# Altium project tumlerV2.PrjPcb
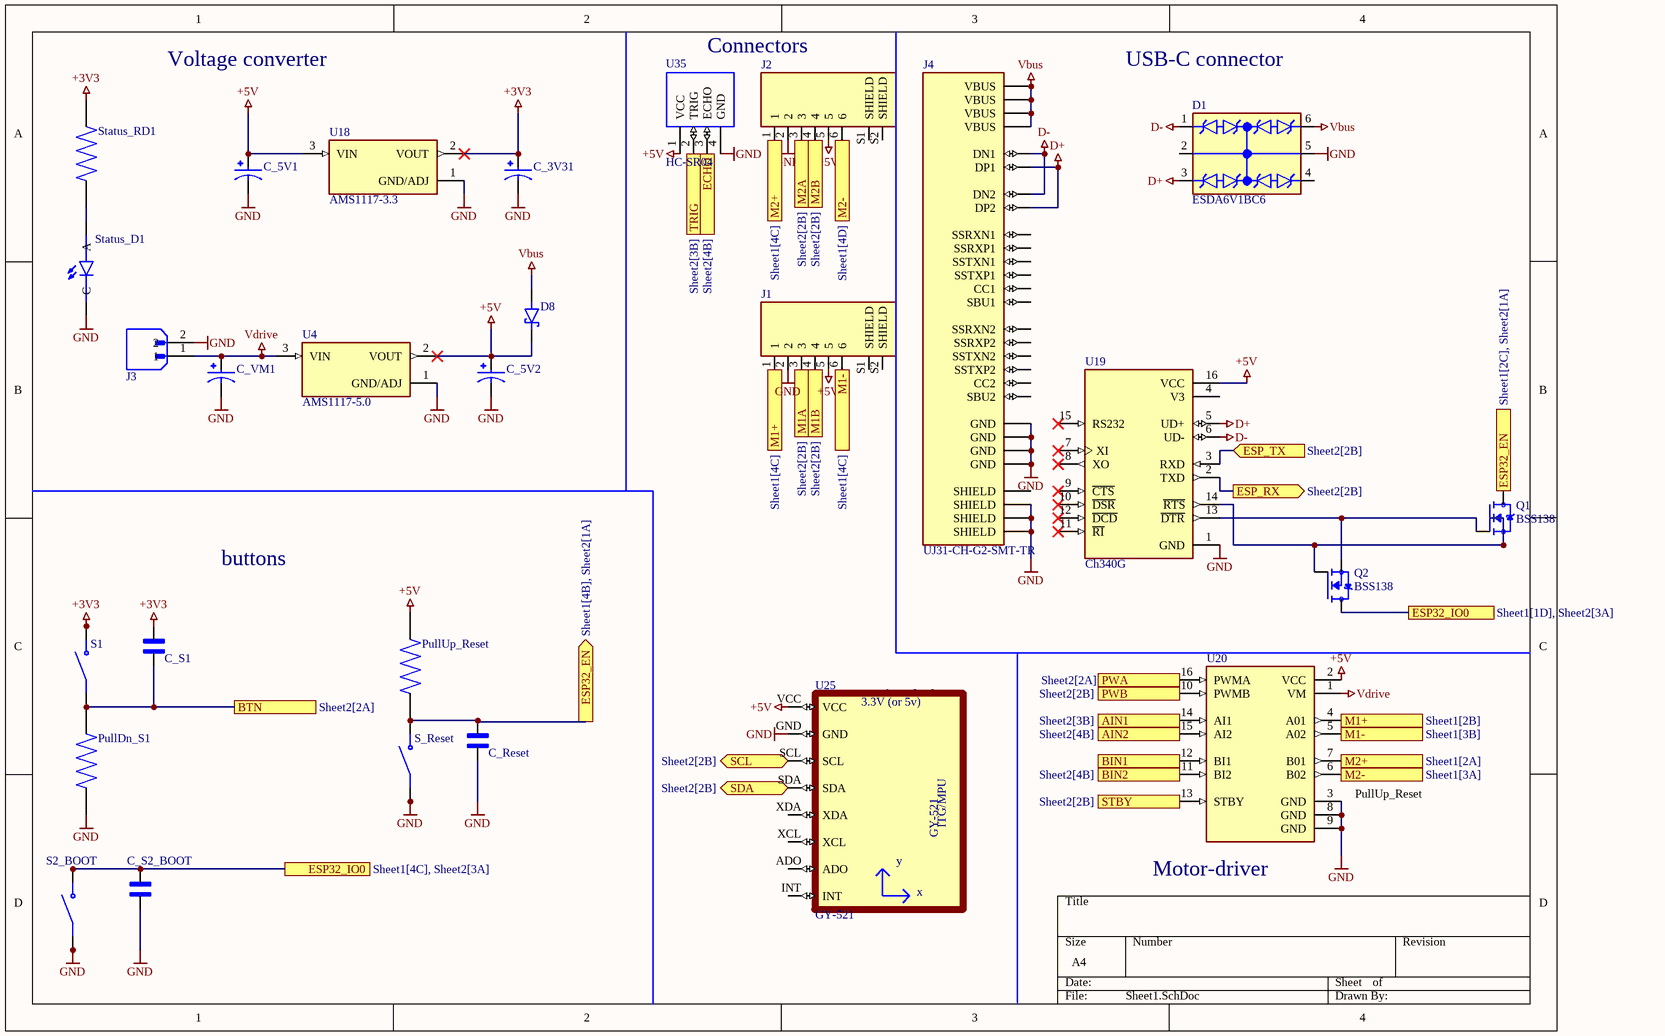
[diagram p0: Sheet1.SchDoc]
3 sheets, 55 parts. Net scope: flat (ports and power ports of the same name join across sheets).
Board file: PCB2.PcbDoc
Sheets:
  Sheet1.SchDoc
  Sheet3.SchDoc
  Sheet2.SchDoc

## Sheet Sheet1.SchDoc
size A4; SheetNumber: 1; SheetTotal: 3

### Parts
C_3V31  EEE-HC1H3R3R  [CAP_EEEHC1H3R3R]  (value not drawn)
C_5V1  EEE-HC1H3R3R  [CAP_EEEHC1H3R3R]  (value not drawn)
C_5V2  EEE-HC1H3R3R  [CAP_EEEHC1H3R3R]  (value not drawn)
C_Reset  GRM033R61C224ME14D  [CAPC0603X33N]  (value not drawn)
C_S1  GRM033R61C224ME14D  [CAPC0603X33N]  (value not drawn)
C_S2_BOOT  GRM033R61C224ME14D  [CAPC0603X33N]  (value not drawn)
C_VM1  EEE-HC1H3R3R  [CAP_EEEHC1H3R3R]  (value not drawn)
D1  ESDA6V1BC6  [SOT95P280X145-6N]
D8  1N5819HW-7  [SOD3715X145N]  (value not drawn)
J1  S6B-PH-SM4-TB (LF)(SN)  [JST_S6B-PH-SM4-TB(LF)(SN)]  (value not drawn)
J2  S6B-PH-SM4-TB (LF)(SN)  [JST_S6B-PH-SM4-TB(LF)(SN)]  (value not drawn)
J3  S2B-XH-A-1(LF)(SN)  [JST_S2B-XH-A-1(LF)(SN)]  (value not drawn)
J4  UJ31-CH-G2-SMT-TR  [CUI_UJ31-CH-G2-SMT-TR]
PullDn_S1  CRG0402F4K7  [RESC1005X40N]  (value not drawn)
PullUp_Reset  CRG0402F4K7  [RESC1005X40N]  (value not drawn)
Q1  BSS138  [SOT95P240X111-3N]
Q2  BSS138  [SOT95P240X111-3N]
S1  FSM2JSMLTR  [SW_1571527-2]  (value not drawn)
S2_BOOT  FSM2JSMLTR  [SW_1571527-2]  (value not drawn)
S_Reset  FSM2JSMLTR  [SW_1571527-2]  (value not drawn)
Status_D1  597-5004-407F  [LEDSC160X80X70L45N]  (value not drawn)
Status_RD1  CRG0201F1K4  [RESC0603X26N]  (value not drawn)
U4  AMS1117-5.0  [SOT229P700X180-4N]
U18  AMS1117-3.3  [SOT229P700X180-4N]
U19  Ch340G  [SOIC127P600X180-16N]
U20  ROB-14450  [MODULE_ROB-14450]  (value not drawn)
U25  GY-521  [GY-521]
U35  HC-SR04  [XCVR_HC-SR04]

### Ports
AIN1 (in, see Sheet2[3B]), AIN2 (in, see Sheet2[4B]), BIN1 (in, see Sheet2[3B]), BIN2 (in, see Sheet2[4B]), BTN (see Sheet2[2A]), ECHO (see Sheet2[4B]), ESP32_EN (out, see Sheet1[2C], Sheet2[1A]), ESP32_EN (out, see Sheet1[4B], Sheet2[1A]), ESP32_IO0 (see Sheet1[1D], Sheet2[3A]), ESP32_IO0 (see Sheet1[4C], Sheet2[3A]), ESP_RX (out, see Sheet2[2B]), ESP_TX (in, see Sheet2[2B]), M1+ (out, see Sheet1[2B]), M1+ (out, see Sheet1[4C]), M1- (out, see Sheet1[3B]), M1- (out, see Sheet1[4C]), M1A (see Sheet2[2B]), M1B (see Sheet2[2B]), M2+ (out, see Sheet1[2A]), M2+ (out, see Sheet1[4C]), M2- (out, see Sheet1[3A]), M2- (out, see Sheet1[4D]), M2A (see Sheet2[2B]), M2B (see Sheet2[2B]), PWA (in, see Sheet2[2A]), PWB (in, see Sheet2[2B]), SCL (bidir, see Sheet2[2B]), SDA (bidir, see Sheet2[2B]), STBY (in, see Sheet2[2B]), TRIG (see Sheet2[3B])

### Nets
+3V3: C_3V31.1 C_S1.2 S1.3(NO) S1.4(NO) Status_RD1.1 U18.2(VOUT)
+5V: C_5V1.1 C_5V2.1 D8.C(K) J1.5 J2.5 PullUp_Reset.2 U4.2(VOUT) U18.3(VIN) U19.16(VCC) U20.2(VCC) U25.VCC U35.1(VCC)
D+: D1.3(C2) J4.A6(DP1) J4.B6(DP2) U19.5(UD+)
D-: D1.1(C1) J4.A7(DN1) J4.B7(DN2) U19.6(UD-)
GND: C_3V31.2 C_5V1.2 C_5V2.2 C_Reset.1 C_S2_BOOT.2 C_VM1.2 D1.5(CC2) J1.2 J2.2 J3.2 J4.A1(GND) J4.A12(GND) J4.B1(GND) J4.B12(GND) J4.SH2(SHIELD) J4.SH3(SHIELD) J4.SH4(SHIELD) PullDn_S1.1 S2_BOOT.1(COM) S2_BOOT.2(COM) S_Reset.1(COM) S_Reset.2(COM) Status_D1.C U4.1(GND/ADJ) U18.1(GND/ADJ) U19.1(GND) U20.3(GND) U20.8(GND) U20.9(GND) U25.GND U35.4(GND)
Vbus: D1.6(C4) D8.A J4.A4(VBUS) J4.A9(VBUS) J4.B4(VBUS) J4.B9(VBUS)
Vdrive: C_VM1.1 J3.1 U4.3(VIN) U20.1(VM)
Net35_3: C_Reset.2 PullUp_Reset.1 Q1.3(D) S_Reset.3(NO) S_Reset.4(NO) ; port ESP32_EN
Net35_10: J2.4 ; port M2B
Net35_11: J1.4 ; port M1B
Net35_12: J1.3 ; port M1A
Net35_14: U35.3(ECHO) ; port ECHO
Net35_24: C_S1.1 PullDn_S1.2 S1.1(COM) S1.2(COM) ; port BTN
Net35_25: C_S2_BOOT.1 Q2.3(D) S2_BOOT.3(NO) S2_BOOT.4(NO) ; port ESP32_IO0
Net35_26: U20.16(PWMA) ; port PWA
Net35_27: U20.14(AI1) ; port AIN1
Net35_28: U20.13(STBY) ; port STBY
Net35_29: U35.2(TRIG) ; port TRIG
Net35_30: U20.10(PWMB) ; port PWB
Net35_31: J2.3 ; port M2A
Net35_33: U25.SDA ; port SDA
Net35_34: U19.2(TXD) ; port ESP_RX
Net35_35: U19.3(RXD) ; port ESP_TX
Net35_36: U25.SCL ; port SCL
Net35_37: U20.12(BI1) ; port BIN1
NetJ1_1: J1.1 U20.4(A01) ; port M1+
NetJ1_6: J1.6 U20.5(A02) ; port M1-
NetJ2_1: J2.1 U20.7(B01) ; port M2+
NetJ2_6: J2.6 U20.6(B02) ; port M2-
NetQ1_1: Q1.1(G) Q2.2(S) U19.13(~{DTR})
NetQ1_2: Q1.2(S) Q2.1(G) U19.14(~{RTS})
NetStatus_D1_A: Status_D1.A Status_RD1.2
NetU20_11: U20.11(BI2) ; port BIN2
NetU20_15: U20.15(AI2) ; port AIN2

Not connected (* = marked no-connect by the designer): D1 2(CC1) 4(C3); J1 S1(SHIELD) S2(SHIELD); J2 S1(SHIELD) S2(SHIELD); J4 A2(SSTXP1) A3(SSTXN1) A5(CC1) A8(SBU1) A10(SSRXN2) A11(SSRXP2) B2(SSTXP2) B3(SSTXN2) B5(CC2) B8(SBU2) B10(SSRXN1) B11(SSRXP1) SH1(SHIELD); U19 4(V3) 7(XI)* 8(XO)* 9(~{CTS})* 10(~{DSR})* 11(~{RI})* 12(~{DCD})* 15(RS232)*; U25 ADO INT XCL XDA

### Notes on the sheet
- Voltage converter
- Connectors
- USB-C connector
- buttons
- (near U20) PullUp_Reset
- (near U20) Motor-driver
- (in symbol GY-521) 3.3V (or 5v); ITG/MPU; y; x

### Library data of the parts
C_3V31 C_5V1 C_5V2 C_VM1 = EEE-HC1H3R3R: 10uF 16V dc Aluminium Electrolytic Capacitor; HC SMD Series 3000h 4(Dia.)x5.8mm; Value: 10µF; MF: Panasonic; Package: RADIAL-2 Panasonic; Availability: In Stock; Check_prices: https://www.snapeda.com/parts/EEE-HC1H3R3R/Panasonic/view-part/2309274/?ref=eda; Price: None; SnapEDA_Link: https://www.snapeda.com/parts/EEE-HC1H3R3R/Panasonic/view-part/2309274/?ref=snap; MP: EEE-HC1H3R3R; Supplier 1: Arrow Electronics; Supplier Part Number 1: VES100M1CTR-0405
C_Reset C_S1 C_S2_BOOT = GRM033R61C224ME14D: 0603; Value: 100n; MF: Murata; SnapEDA_Link: https://www.snapeda.com/parts/GRM033R61C224ME14D/Murata/view-part/?ref=snap; Package: 0603 Murata; MP: GRM033R61C224ME14D; Check_prices: https://www.snapeda.com/parts/GRM033R61C224ME14D/Murata/view-part/?ref=eda; ID: GRM033R61C224ME14D
D1 = ESDA6V1BC6: - Clamp - Ipp Tvs Diode Surface Mount SOT-23-6; MF: STMicroelectronics; Value: *; Price: None; Purchase-URL: https://pricing.snapeda.com/search/part/ESDA6V1BC6/?ref=eda; Package: SOT-23-6 STMicroelectronics; MP: ESDA6V1BC6; Availability: In Stock; Check_prices: https://www.snapeda.com/parts/ESDA6V1BC6/STMicroelectronics/view-part/?ref=eda; SnapEDA_Link: https://www.snapeda.com/parts/ESDA6V1BC6/STMicroelectronics/view-part/?ref=snap; Supplier 1: Mouser; Supplier Part Number 1: 511-ESDA6V1BC6
D8 = 1N5819HW-7: Diode Schottky 40 V 1A Surface Mount SOD-123; MF: Diodes Inc.; SnapEDA_Link: https://www.snapeda.com/parts/1N5819HW-7/Diodes+Inc./view-part/?ref=snap; Price: None; Check_prices: https://www.snapeda.com/parts/1N5819HW-7/Diodes+Inc./view-part/?ref=eda; Availability: In Stock; Value: *; MP: 1N5819HW-7; Package: SOD-123 Fairchild Semiconductor; Purchase-URL: https://pricing.snapeda.com/search/part/1N5819HW-7/?ref=eda
J1 J2 = S6B-PH-SM4-TB (LF)(SN): Connector Header Surface Mount, Right Angle 6 position 0.079 (2.00mm); MF: JST Sales; SnapEDA_Link: https://www.snapeda.com/parts/S6B-PH-SM4-TB%20(LF)(SN)/JST/view-part/?ref=snap; Package: None; Value: *; MP: S6B-PH-SM4-TB (LF)(SN); Check_prices: https://www.snapeda.com/parts/S6B-PH-SM4-TB%20(LF)(SN)/JST/view-part/?ref=eda; Supplier 1: Rs; Supplier Part Number 1: 6881369P
J3 = S2B-XH-A-1(LF)(SN): Connector Header Through Hole, Right Angle 2 position 0.098 (2.50mm); MF: JST Sales; SnapEDA_Link: https://www.snapeda.com/parts/S2B-XH-A-1(LF)(SN)/JST+Sales+America+Inc./view-part/?ref=snap; Package: None; Value: *; MP: S2B-XH-A-1(LF)(SN); Check_prices: https://www.snapeda.com/parts/S2B-XH-A-1(LF)(SN)/JST+Sales+America+Inc./view-part/?ref=eda; Supplier 1: Mouser; Supplier Part Number 1: 306-S2BXHA1LFSN
J4 = UJ31-CH-G2-SMT-TR: Type C, USB 3.2 Gen 2, 10 Gbps, 20 Vdc, 5 A, Right Angle, Surface Mount, Black Insulator, USB Receptacle; MF: Same Sky; SnapEDA_Link: https://www.snapeda.com/parts/UJ31-CH-G2-SMT-TR/Same+Sky/view-part/?ref=snap; Package: None; Value: *; MP: UJ31-CH-G2-SMT-TR; Check_prices: https://www.snapeda.com/parts/UJ31-CH-G2-SMT-TR/Same+Sky/view-part/?ref=eda; Supplier 1: Mouser; Supplier Part Number 1: 490-UJ31-CH-G2SMT-TR
PullDn_S1 PullUp_Reset = CRG0402F4K7: Thick Film Smnt Resistor 0402 Case 4.7kOhm +/-1% 0.063W +/-100ppm/degC | TE Connectivity CRG0402F4K7; Power_Rating: .063 W; Resistance: 10k; Voltage_Rating: 50 V; Tolerance: 1%; SnapEDA_Link: https://www.snapeda.com/parts/CRG0402F4K7/TE+Connectivity+Passive+Product/view-part/?ref=snap; Package: 0402; Value: *; MF: TE Connectivity; MP: CRG0402F4K7; Check_prices: https://www.snapeda.com/parts/CRG0402F4K7/TE+Connectivity+Passive+Product/view-part/?ref=eda
Q1 Q2 = BSS138: N-Channel 50 V 220mA (Ta) 350mW (Ta) Surface Mount SOT-23-3; MF: onsemi; SnapEDA_Link: https://www.snapeda.com/parts/BSS138/Onsemi/view-part/?ref=snap; Package: SOT-23-3 ON Semiconductor; Value: *; MP: BSS138; Check_prices: https://www.snapeda.com/parts/BSS138/Onsemi/view-part/?ref=eda; Supplier 1: Future Electronics; Supplier Part Number 1: 7723794
S1 S2_BOOT S_Reset = FSM2JSMLTR: Switch Tactile OFF (ON) SPST Round Button Gull Wing 0.05A 24VDC 0.98N SMD T/R; MF: TE Connectivity; SnapEDA_Link: https://www.snapeda.com/parts/FSM2JSMLTR/TE+Connectivity+ALCOSWITCH+Switches/view-part/?ref=snap; Package: None; Value: *; MP: FSM2JSMLTR; Check_prices: https://www.snapeda.com/parts/FSM2JSMLTR/TE+Connectivity+ALCOSWITCH+Switches/view-part/?ref=eda; Supplier 1: Avnet; Supplier Part Number 1: 23R8458
Status_D1 = 597-5004-407F: SMD LED 0603 R 7 REEL; Discretes | Dialight 597-5004-407F; SnapEDA_Link: https://www.snapeda.com/parts/597-5004-407F/Dialight/view-part/?ref=snap; Package: 0603 Dialight; Value: *; MF: Dialight; MP: 597-5004-407F; Check_prices: https://www.snapeda.com/parts/597-5004-407F/Dialight/view-part/?ref=eda; Supplier 1: Farnell; Supplier Part Number 1: 1867024
Status_RD1 = CRG0201F1K4: Res Thick Film 0201 100 Ohm 1% 1/20W Â±200ppm/Â°C Molded SMD T/R; Power_Rating: .05 W; Resistance: 100; MF: TE Connectivity; Voltage_Rating: 25 V; SnapEDA_Link: https://www.snapeda.com/parts/CRG0201F1K4/TE+Connectivity/view-part/?ref=snap; Package: 0201; Value: *; MP: CRG0201F1K4; EU_RoHS_Compliance: Compliant with Exemptions; Tolerance: 1%; Check_prices: https://www.snapeda.com/parts/CRG0201F1K4/TE+Connectivity/view-part/?ref=eda; Supplier 1: Rs; Supplier Part Number 1: 7550164
U4 = AMS1117-5.0: 1A LOW DROPOUT VOLTAGE REGULATOR; MF: ams; SnapEDA_Link: https://www.snapeda.com/parts/AMS1117-5.0/ams/view-part/?ref=snap; Package: SOT-223 Seeed Technology; Value: *; MP: AMS1117-5.0; Check_prices: https://www.snapeda.com/parts/AMS1117-5.0/ams/view-part/?ref=eda
U18 = AMS1117-3.3: Sot223/Pkg 1-Amp 3.3-Volt Low Drop Out Voltage Regulatator; MF: Advanced Monolithic Systems; SnapEDA_Link: https://www.snapeda.com/parts/AMS1117-3.3/Advanced+Monolithic+Systems/view-part/?ref=snap; Package: SOT-223 Seeed Technology; Value: *; MP: AMS1117-3.3; Check_prices: https://www.snapeda.com/parts/AMS1117-3.3/Advanced+Monolithic+Systems/view-part/?ref=eda; Supplier 1: Digikey; Supplier Part Number 1: 4518-AMS1117-3.3CT-ND
U19 = Ch340G: USB Interface Integrated Circuit; MF: WCH; SnapEDA_Link: https://www.snapeda.com/parts/Ch340G/WCH/view-part/?ref=snap; Package: None; Value: *; MP: Ch340G; Check_prices: https://www.snapeda.com/parts/Ch340G/WCH/view-part/?ref=eda
U20 = ROB-14450: TB6612FNG Motor Controller/Driver Power Management Evaluation Board; MF: SparkFun Electronics; Check_prices: https://www.snapeda.com/parts/ROB-14450/SparkFun%20Electronics/view-part/2656367/?ref=eda; Package: None; MP: ROB-14450; Value: *; Availability: In Stock; SnapEDA_Link: https://www.snapeda.com/parts/ROB-14450/SparkFun%20Electronics/view-part/2656367/?ref=snap; Price: None
U25 = GY-521: Triple Axis Accelerometer Gyro Breakout; MF: GODREAM FORDREAM CO., LIMITED; SnapEDA_Link: https://www.snapeda.com/parts/GY-521/GODREAM+FORDREAM+CO.%252C+LIMITED/view-part/?ref=snap; Package: Package; Value: *; MP: GY-521; Check_prices: https://www.snapeda.com/parts/GY-521/GODREAM+FORDREAM+CO.%252C+LIMITED/view-part/?ref=eda
U35 = HC-SR04: Ultrasonic Sensor Module; Availability: Unavailable; MP: HC-SR04; Value: *; Price: None; Package: None

## Sheet Sheet3.SchDoc
size A4; SheetNumber: 2; SheetTotal: 3
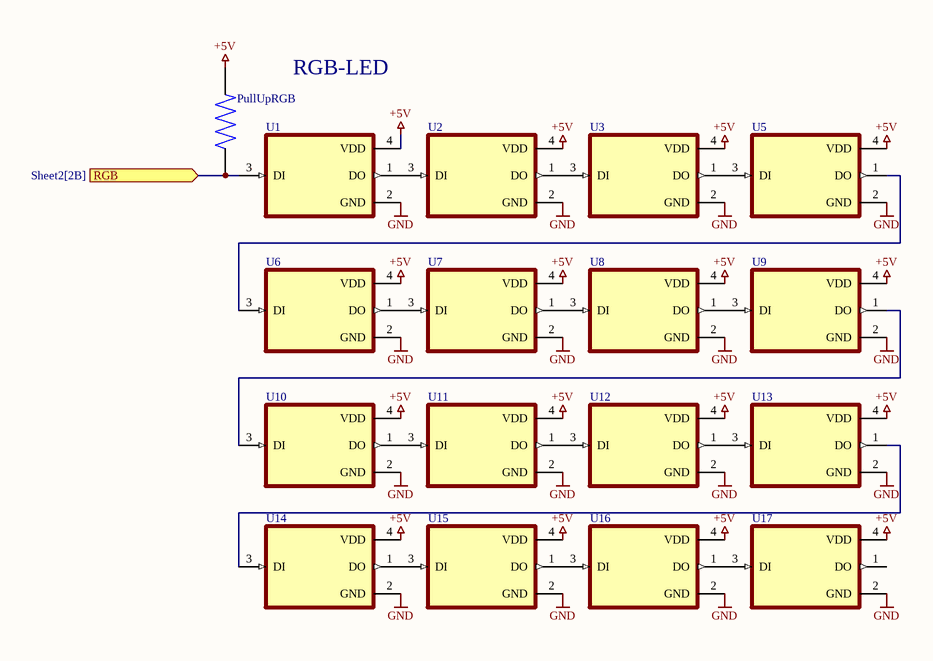
[diagram p1: Sheet3.SchDoc]

### Parts
PullUpRGB  CRG0402F4K7  [RESC1005X40N]  (value not drawn)
U1  WS2812-2020  [LED_WS2812-2020]  (value not drawn)
U2  WS2812-2020  [LED_WS2812-2020]  (value not drawn)
U3  WS2812-2020  [LED_WS2812-2020]  (value not drawn)
U5  WS2812-2020  [LED_WS2812-2020]  (value not drawn)
U6  WS2812-2020  [LED_WS2812-2020]  (value not drawn)
U7  WS2812-2020  [LED_WS2812-2020]  (value not drawn)
U8  WS2812-2020  [LED_WS2812-2020]  (value not drawn)
U9  WS2812-2020  [LED_WS2812-2020]  (value not drawn)
U10  WS2812-2020  [LED_WS2812-2020]  (value not drawn)
U11  WS2812-2020  [LED_WS2812-2020]  (value not drawn)
U12  WS2812-2020  [LED_WS2812-2020]  (value not drawn)
U13  WS2812-2020  [LED_WS2812-2020]  (value not drawn)
U14  WS2812-2020  [LED_WS2812-2020]  (value not drawn)
U15  WS2812-2020  [LED_WS2812-2020]  (value not drawn)
U16  WS2812-2020  [LED_WS2812-2020]  (value not drawn)
U17  WS2812-2020  [LED_WS2812-2020]  (value not drawn)

### Ports
RGB (in, see Sheet2[2B])

### Nets
+5V: PullUpRGB.2 U1.4(VDD) U2.4(VDD) U3.4(VDD) U5.4(VDD) U6.4(VDD) U7.4(VDD) U8.4(VDD) U9.4(VDD) U10.4(VDD) U11.4(VDD) U12.4(VDD) U13.4(VDD) U14.4(VDD) U15.4(VDD) U16.4(VDD) U17.4(VDD)
GND: U1.2(GND) U2.2(GND) U3.2(GND) U5.2(GND) U6.2(GND) U7.2(GND) U8.2(GND) U9.2(GND) U10.2(GND) U11.2(GND) U12.2(GND) U13.2(GND) U14.2(GND) U15.2(GND) U16.2(GND) U17.2(GND)
Net35_23: PullUpRGB.1 U1.3(DI) ; port RGB
NetU1_1: U1.1(DO) U2.3(DI)
NetU2_1: U2.1(DO) U3.3(DI)
NetU3_1: U3.1(DO) U5.3(DI)
NetU5_1: U5.1(DO) U6.3(DI)
NetU6_1: U6.1(DO) U7.3(DI)
NetU7_1: U7.1(DO) U8.3(DI)
NetU8_1: U8.1(DO) U9.3(DI)
NetU9_1: U9.1(DO) U10.3(DI)
NetU10_1: U10.1(DO) U11.3(DI)
NetU11_1: U11.1(DO) U12.3(DI)
NetU12_1: U12.1(DO) U13.3(DI)
NetU13_1: U13.1(DO) U14.3(DI)
NetU14_1: U14.1(DO) U15.3(DI)
NetU15_1: U15.1(DO) U16.3(DI)
NetU16_1: U16.1(DO) U17.3(DI)

Not connected (* = marked no-connect by the designer): U17 1(DO)

### Notes on the sheet
- RGB-LED

### Library data of the parts
PullUpRGB = CRG0402F4K7: as PullDn_S1 on sheet Sheet1; SnapEDA_Link: https://www.snapeda.com/parts/CRG0402F4K7/TE+Connectivity+Passive+Product/view-part/?ref=snap; Package: 0402; Value: *; MF: TE Connectivity; MP: CRG0402F4K7; Check_prices: https://www.snapeda.com/parts/CRG0402F4K7/TE+Connectivity+Passive+Product/view-part/?ref=eda
U1-U3 U5-U17 = WS2812-2020: Intelligent control LED light source, SMD-4; MF: Worldsemi; MP: WS2812-2020; Availability: Not in stock; Package: Package; SnapEDA_Link: https://www.snapeda.com/parts/WS2812-2020/Worldsemi/view-part/?ref=snap; Check_prices: https://www.snapeda.com/parts/WS2812-2020/Worldsemi/view-part/?ref=eda; Value: *; Price: None
  U1: ComponentLink1Description: New link; ComponentLink1URL: *; Supplier 1: Mouser; Supplier Part Number 1: 485-1655

## Sheet Sheet2.SchDoc
size A4; SheetNumber: 3; SheetTotal: 3
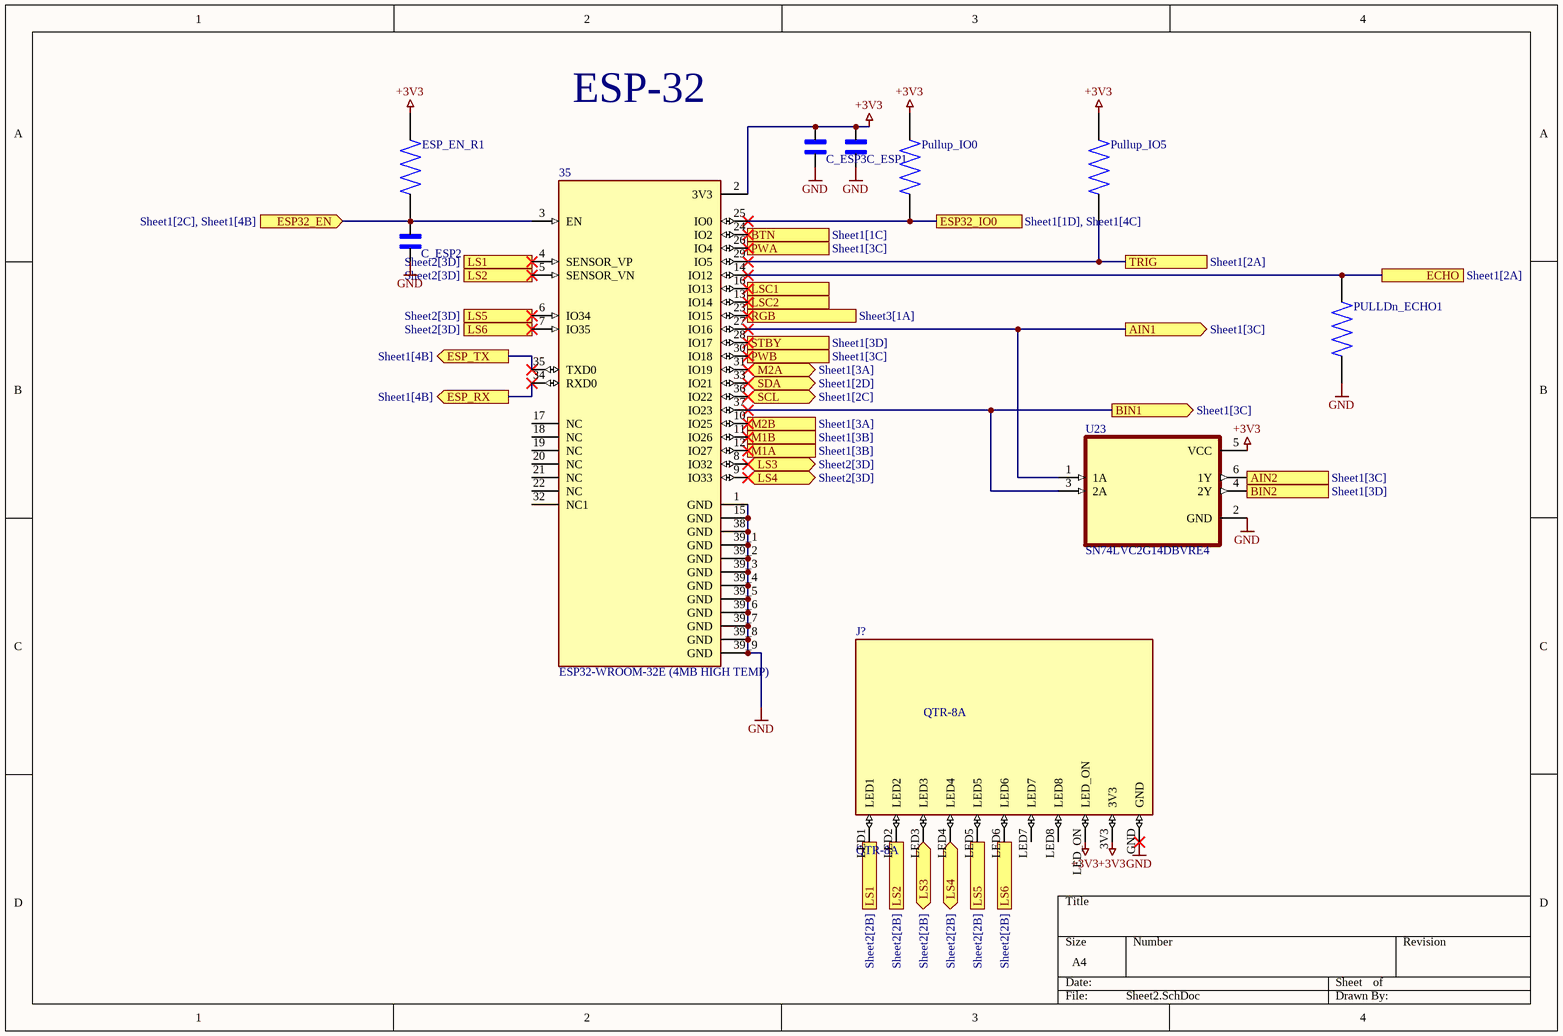
[diagram p2: Sheet2.SchDoc]

### Parts
35  ESP32-WROOM-32E (4MB HIGH TEMP)  [XCVR_ESP32-WROOM-32E_(4MB_HIGH_TEMP)]
C_ESP1  GRM033R61C224ME14D  [CAPC0603X33N]  (value not drawn)
C_ESP2  GRM033R61C224ME14D  [CAPC0603X33N]  (value not drawn)
C_ESP3  GRM033R61C224ME14D  [CAPC0603X33N]  (value not drawn)
ESP_EN_R1  CRG0402F4K7  [RESC1005X40N]  (value not drawn)
J?  QTR-8A  [QTR-8A]
PULLDn_ECHO1  CRG0402F4K7  [RESC1005X40N]  (value not drawn)
Pullup_IO0  CRG0402F4K7  [RESC1005X40N]  (value not drawn)
Pullup_IO5  CRG0402F4K7  [RESC1005X40N]  (value not drawn)
U23  SN74LVC2G14DBVRE4  [SOT95P280X145-6N]

### Ports
AIN1 (out, see Sheet1[3C]), AIN2 (out, see Sheet1[3C]), BIN1 (out, see Sheet1[3C]), BIN2 (out, see Sheet1[3D]), BTN (see Sheet1[1C]), ECHO (see Sheet1[2A]), ESP32_EN (in, see Sheet1[2C], Sheet1[4B]), ESP32_IO0 (see Sheet1[1D], Sheet1[4C]), ESP_RX (out, see Sheet1[4B]), ESP_TX (out, see Sheet1[4B]), LS1 (see Sheet2[2B]), LS1 (see Sheet2[3D]), LS2 (see Sheet2[2B]), LS2 (see Sheet2[3D]), LS3 (bidir, see Sheet2[2B]), LS3 (bidir, see Sheet2[3D]), LS4 (bidir, see Sheet2[2B]), LS4 (bidir, see Sheet2[3D]), LS5 (see Sheet2[2B]), LS5 (see Sheet2[3D]), LS6 (see Sheet2[2B]), LS6 (see Sheet2[3D]), LSC1, LSC2, M1A (see Sheet1[3B]), M1B (see Sheet1[3B]), M2A (bidir, see Sheet1[3A]), M2B (see Sheet1[3A]), PWA (out, see Sheet1[3C]), PWB (out, see Sheet1[3C]), RGB (out, see Sheet3[1A]), SCL (bidir, see Sheet1[2C]), SDA (bidir, see Sheet1[2D]), STBY (out, see Sheet1[3D]), TRIG (see Sheet1[2A])

### Nets
+3V3: 35.2(3V3) C_ESP1.2 C_ESP3.2 ESP_EN_R1.2 J?.3V3 J?.LED_ON Pullup_IO0.2 Pullup_IO5.2 U23.5(VCC)
GND: 35.1(GND) 35.15(GND) 35.38(GND) 35.39_1(GND) 35.39_2(GND) 35.39_3(GND) 35.39_4(GND) 35.39_5(GND) 35.39_6(GND) 35.39_7(GND) 35.39_8(GND) 35.39_9(GND) C_ESP1.1 C_ESP2.1 C_ESP3.1 J?.GND PULLDn_ECHO1.1 U23.2(GND)
Net35_3: 35.3(EN) C_ESP2.2 ESP_EN_R1.1 ; port ESP32_EN
Net35_4: 35.4(SENSOR_VP) J?.LED1 ; port LS1
Net35_5: 35.5(SENSOR_VN) J?.LED2 ; port LS2
Net35_6: 35.6(IO34) J?.LED5 ; port LS5
Net35_7: 35.7(IO35) J?.LED6 ; port LS6
Net35_8: 35.8(IO32) J?.LED3 ; port LS3
Net35_9: 35.9(IO33) J?.LED4 ; port LS4
Net35_10: 35.10(IO25) ; port M2B
Net35_11: 35.11(IO26) ; port M1B
Net35_12: 35.12(IO27) ; port M1A
Net35_13: 35.13(IO14) ; port LSC2
Net35_14: 35.14(IO12) PULLDn_ECHO1.2 ; port ECHO
Net35_16: 35.16(IO13) ; port LSC1
Net35_23: 35.23(IO15) ; port RGB
Net35_24: 35.24(IO2) ; port BTN
Net35_25: 35.25(IO0) Pullup_IO0.1 ; port ESP32_IO0
Net35_26: 35.26(IO4) ; port PWA
Net35_27: 35.27(IO16) U23.1(1A) ; port AIN1
Net35_28: 35.28(IO17) ; port STBY
Net35_29: 35.29(IO5) Pullup_IO5.1 ; port TRIG
Net35_30: 35.30(IO18) ; port PWB
Net35_31: 35.31(IO19) ; port M2A
Net35_33: 35.33(IO21) ; port SDA
Net35_34: 35.34(RXD0) ; port ESP_RX
Net35_35: 35.35(TXD0) ; port ESP_TX
Net35_36: 35.36(IO22) ; port SCL
Net35_37: 35.37(IO23) U23.3(2A) ; port BIN1
NetU20_11: U23.4(2Y) ; port BIN2
NetU20_15: U23.6(1Y) ; port AIN2

Not connected (* = marked no-connect by the designer): 35 17(NC) 18(NC) 19(NC) 20(NC) 21(NC) 22(NC) 32(NC1); J? LED7 LED8

### Notes on the sheet
- ESP-32

### Library data of the parts
35 = ESP32-WROOM-32E (4MB HIGH TEMP): MF: Espressif Systems; Package: SMD-44 Espressif Systems; Check_prices: https://www.snapeda.com/parts/ESP32-WROOM-32E%20(4MB%20HIGH%20TEMP)/Espressif+Systems/view-part/?ref=eda; Value: *; Price: None; MP: ESP32-WROOM-32E (4MB HIGH TEMP); Purchase-URL: https://pricing.snapeda.com/search/part/ESP32-WROOM-32E (4MB HIGH TEMP)/?ref=eda; SnapEDA_Link: https://www.snapeda.com/parts/ESP32-WROOM-32E%20(4MB%20HIGH%20TEMP)/Espressif+Systems/view-part/?ref=snap; Availability: In Stock; ID: ESP32-WROOM-32E (4MB HIGH TEMP); Supplier 1: Digikey; Supplier Part Number 1: 1904-ESP32-WROOM-32E(M113EH3200PH3Q0)TR-ND
C_ESP1 = GRM033R61C224ME14D: 0603; Value: 1µ; MF: Murata; SnapEDA_Link: https://www.snapeda.com/parts/GRM033R61C224ME14D/Murata/view-part/?ref=snap; Package: 0603 Murata; MP: GRM033R61C224ME14D; Check_prices: https://www.snapeda.com/parts/GRM033R61C224ME14D/Murata/view-part/?ref=eda; ID: GRM033R61C224ME14D; Supplier 1: Avnet; Supplier Part Number 1: LMK107B7105KA-T; Supplier 2: Mouser; Supplier Part Number 2: 81-GCM188R71E105KA4D
C_ESP2 = GRM033R61C224ME14D: 0603 100n; MF: Murata; SnapEDA_Link: https://www.snapeda.com/parts/GRM033R61C224ME14D/Murata/view-part/?ref=snap; Package: 0603 Murata; Value: 100n; MP: GRM033R61C224ME14D; Check_prices: https://www.snapeda.com/parts/GRM033R61C224ME14D/Murata/view-part/?ref=eda; ID: GRM033R61C224ME14D; Supplier 1: Mouser; Supplier Part Number 1: 81-GRM033R61C224ME4D
C_ESP3 = GRM033R61C224ME14D: 0603; Value: 10µ; MF: Murata; SnapEDA_Link: https://www.snapeda.com/parts/GRM033R61C224ME14D/Murata/view-part/?ref=snap; Package: 0603 Murata; MP: GRM033R61C224ME14D; Check_prices: https://www.snapeda.com/parts/GRM033R61C224ME14D/Murata/view-part/?ref=eda; ID: GRM033R61C224ME14D; Supplier 1: Mouser; Supplier Part Number 1: 810-C1608X5R1E225K
ESP_EN_R1 = CRG0402F4K7: Thick Film Smnt Resistor 0402 Case 10kOhm +/-1% 0.063W +/-100ppm/degC | TE Connectivity; Power_Rating: .063 W; Resistance: 10k; Voltage_Rating: 50 V; Tolerance: 1%; SnapEDA_Link: https://www.snapeda.com/parts/CRG0402F4K7/TE+Connectivity+Passive+Product/view-part/?ref=snap; Package: 0402; Value: *; MF: TE Connectivity; MP: CRG0402F4K7; Check_prices: https://www.snapeda.com/parts/CRG0402F4K7/TE+Connectivity+Passive+Product/view-part/?ref=eda; Supplier 1: Avnet; Supplier Part Number 1: RC1005F1002CS; Supplier 2: Mouser; Supplier Part Number 2: 667-ERT-J0ER103J; Supplier 3: Farnell; Supplier Part Number 3: 2072516RL
J? = QTR-8A: QRE1113GR series Phototransistor Sensor Evaluation Board; MF: Pololu; SnapEDA_Link: https://www.snapeda.com/parts/QTR-8A/Pololu/view-part/?ref=snap; Package: None; Value: *; MP: QTR-8A; Check_prices: https://www.snapeda.com/parts/QTR-8A/Pololu/view-part/?ref=eda
PULLDn_ECHO1 Pullup_IO0 = CRG0402F4K7: as PullDn_S1 on sheet Sheet1; SnapEDA_Link: https://www.snapeda.com/parts/CRG0402F4K7/TE+Connectivity+Passive+Product/view-part/?ref=snap; Package: 0402; Value: *; MF: TE Connectivity; MP: CRG0402F4K7; Check_prices: https://www.snapeda.com/parts/CRG0402F4K7/TE+Connectivity+Passive+Product/view-part/?ref=eda
  PULLDn_ECHO1: Supplier 1: Mouser; Supplier Part Number 1: 81-NCP15XV103J03RC
Pullup_IO5 = CRG0402F4K7: Thick Film Smnt Resistor 0402 Case 10kOhm +/-1% 0.063W +/-100ppm/degC | TE Connectivity CRG0402F4K7; Power_Rating: .063 W; Resistance: 10k; Voltage_Rating: 50 V; Tolerance: 1%; SnapEDA_Link: https://www.snapeda.com/parts/CRG0402F4K7/TE+Connectivity+Passive+Product/view-part/?ref=snap; Package: 0402; Value: *; MF: TE Connectivity; MP: CRG0402F4K7; Check_prices: https://www.snapeda.com/parts/CRG0402F4K7/TE+Connectivity+Passive+Product/view-part/?ref=eda; Supplier 1: Mouser; Supplier Part Number 1: 81-NCP15XV103J03RC
U23 = SN74LVC2G14DBVRE4: Dual Schmitt-Trigger Inverter 6-SOT-23 -40 to 125; MF: Texas Instruments; Price: None; Availability: In Stock; Check_prices: https://www.snapeda.com/parts/SN74LVC2G14DBVRE4/Texas+Instruments/view-part/?ref=eda; MP: SN74LVC2G14DBVRE4; Package: SOT-23-6 Texas Instruments; SnapEDA_Link: https://www.snapeda.com/parts/SN74LVC2G14DBVRE4/Texas+Instruments/view-part/?ref=snap; Value: *; Purchase-URL: https://pricing.snapeda.com/search/part/SN74LVC2G14DBVRE4/?ref=eda; Supplier 1: Mouser; Supplier Part Number 1: 595-SN74LVC2G14DBVE4

## Nets that join several sheets
+3V3: Sheet1 (6 pins), Sheet2 (9 pins)
+5V: Sheet1 (12 pins), Sheet3 (17 pins)
GND: Sheet1 (31 pins), Sheet3 (16 pins), Sheet2 (18 pins)
Net35_3: Sheet1 (5 pins), Sheet2 (35.3 C_ESP2.2 ESP_EN_R1.1)
Net35_10: Sheet1 (J2.4), Sheet2 (35.10)
Net35_11: Sheet1 (J1.4), Sheet2 (35.11)
Net35_12: Sheet1 (J1.3), Sheet2 (35.12)
Net35_14: Sheet1 (U35.3), Sheet2 (35.14 PULLDn_ECHO1.2)
Net35_23: Sheet3 (PullUpRGB.1 U1.3), Sheet2 (35.23)
Net35_24: Sheet1 (C_S1.1 PullDn_S1.2 S1.1 S1.2), Sheet2 (35.24)
Net35_25: Sheet1 (C_S2_BOOT.1 Q2.3 S2_BOOT.3 S2_BOOT.4), Sheet2 (35.25 Pullup_IO0.1)
Net35_26: Sheet1 (U20.16), Sheet2 (35.26)
Net35_27: Sheet1 (U20.14), Sheet2 (35.27 U23.1)
Net35_28: Sheet1 (U20.13), Sheet2 (35.28)
Net35_29: Sheet1 (U35.2), Sheet2 (35.29 Pullup_IO5.1)
Net35_30: Sheet1 (U20.10), Sheet2 (35.30)
Net35_31: Sheet1 (J2.3), Sheet2 (35.31)
Net35_33: Sheet1 (U25.SDA), Sheet2 (35.33)
Net35_34: Sheet1 (U19.2), Sheet2 (35.34)
Net35_35: Sheet1 (U19.3), Sheet2 (35.35)
Net35_36: Sheet1 (U25.SCL), Sheet2 (35.36)
Net35_37: Sheet1 (U20.12), Sheet2 (35.37 U23.3)
NetU20_11: Sheet1 (U20.11), Sheet2 (U23.4)
NetU20_15: Sheet1 (U20.15), Sheet2 (U23.6)